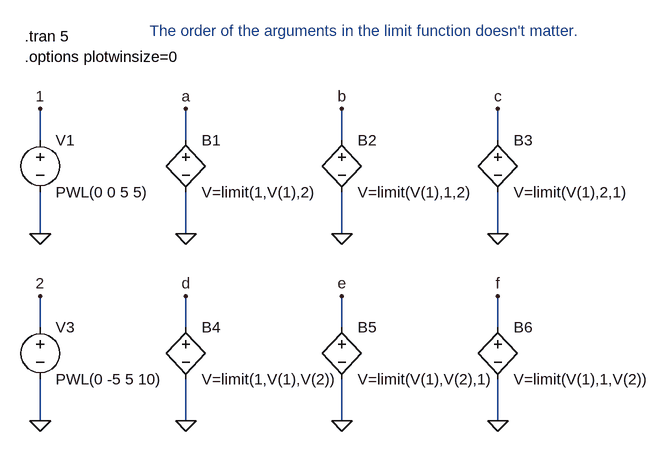
[diagram p0: schematic limit_arguments.asc]
limit_arguments.asc, the LTspice schematic file:
Version 4
SHEET 1 880 680
WIRE -224 192 -224 144
WIRE 0 192 0 144
WIRE 240 192 240 144
WIRE 480 192 480 144
WIRE -224 336 -224 272
WIRE 0 336 0 272
WIRE 240 336 240 272
WIRE 480 336 480 272
WIRE -224 480 -224 432
WIRE 0 480 0 432
WIRE 240 480 240 432
WIRE 480 480 480 432
WIRE -224 624 -224 560
WIRE 0 624 0 560
WIRE 240 624 240 560
WIRE 480 624 480 560
FLAG 0 336 0
FLAG 240 336 0
FLAG 480 336 0
FLAG -224 336 0
FLAG -224 144 1
FLAG 0 144 a
FLAG 240 144 b
FLAG 480 144 c
FLAG 0 624 0
FLAG 240 624 0
FLAG 480 624 0
FLAG 0 432 d
FLAG 240 432 e
FLAG 480 432 f
FLAG -224 624 0
FLAG -224 432 2
SYMBOL bv 0 176 R0
SYMATTR InstName B1
SYMATTR Value V=limit(1,V(1),2)
SYMBOL bv 240 176 R0
SYMATTR InstName B2
SYMATTR Value V=limit(V(1),1,2)
SYMBOL bv 480 176 R0
SYMATTR InstName B3
SYMATTR Value V=limit(V(1),2,1)
SYMBOL voltage -224 176 R0
SYMATTR InstName V1
SYMATTR Value PWL(0 0 5 5)
SYMBOL bv 0 464 R0
SYMATTR InstName B4
SYMATTR Value V=limit(1,V(1),V(2))
SYMBOL bv 240 464 R0
SYMATTR InstName B5
SYMATTR Value V=limit(V(1),V(2),1)
SYMBOL bv 480 464 R0
SYMATTR InstName B6
SYMATTR Value V=limit(V(1),1,V(2))
SYMBOL voltage -224 464 R0
SYMATTR InstName V3
SYMATTR Value PWL(0 -5 5 10)
TEXT -248 32 Left 0 !.tran 5
TEXT -248 64 Left 0 !.options plotwinsize=0
TEXT -56 24 Left 0 ;The order of the arguments in the limit function doesn't matter.

The netlist it stands for:
* limit_arguments.asc
B1 a 0 V=limit(1,V(1),2)
B2 b 0 V=limit(V(1),1,2)
B3 c 0 V=limit(V(1),2,1)
V1 1 0 PWL(0 0 5 5)
B4 d 0 V=limit(1,V(1),V(2))
B5 e 0 V=limit(V(1),V(2),1)
B6 f 0 V=limit(V(1),1,V(2))
V3 2 0 PWL(0 -5 5 10)
.tran 5
.options plotwinsize=0
* The order of the arguments in the limit function doesn't matter.
.backanno
.end